# EAGLE design Arduino-lilypad-USB (EAGLE 6.3)
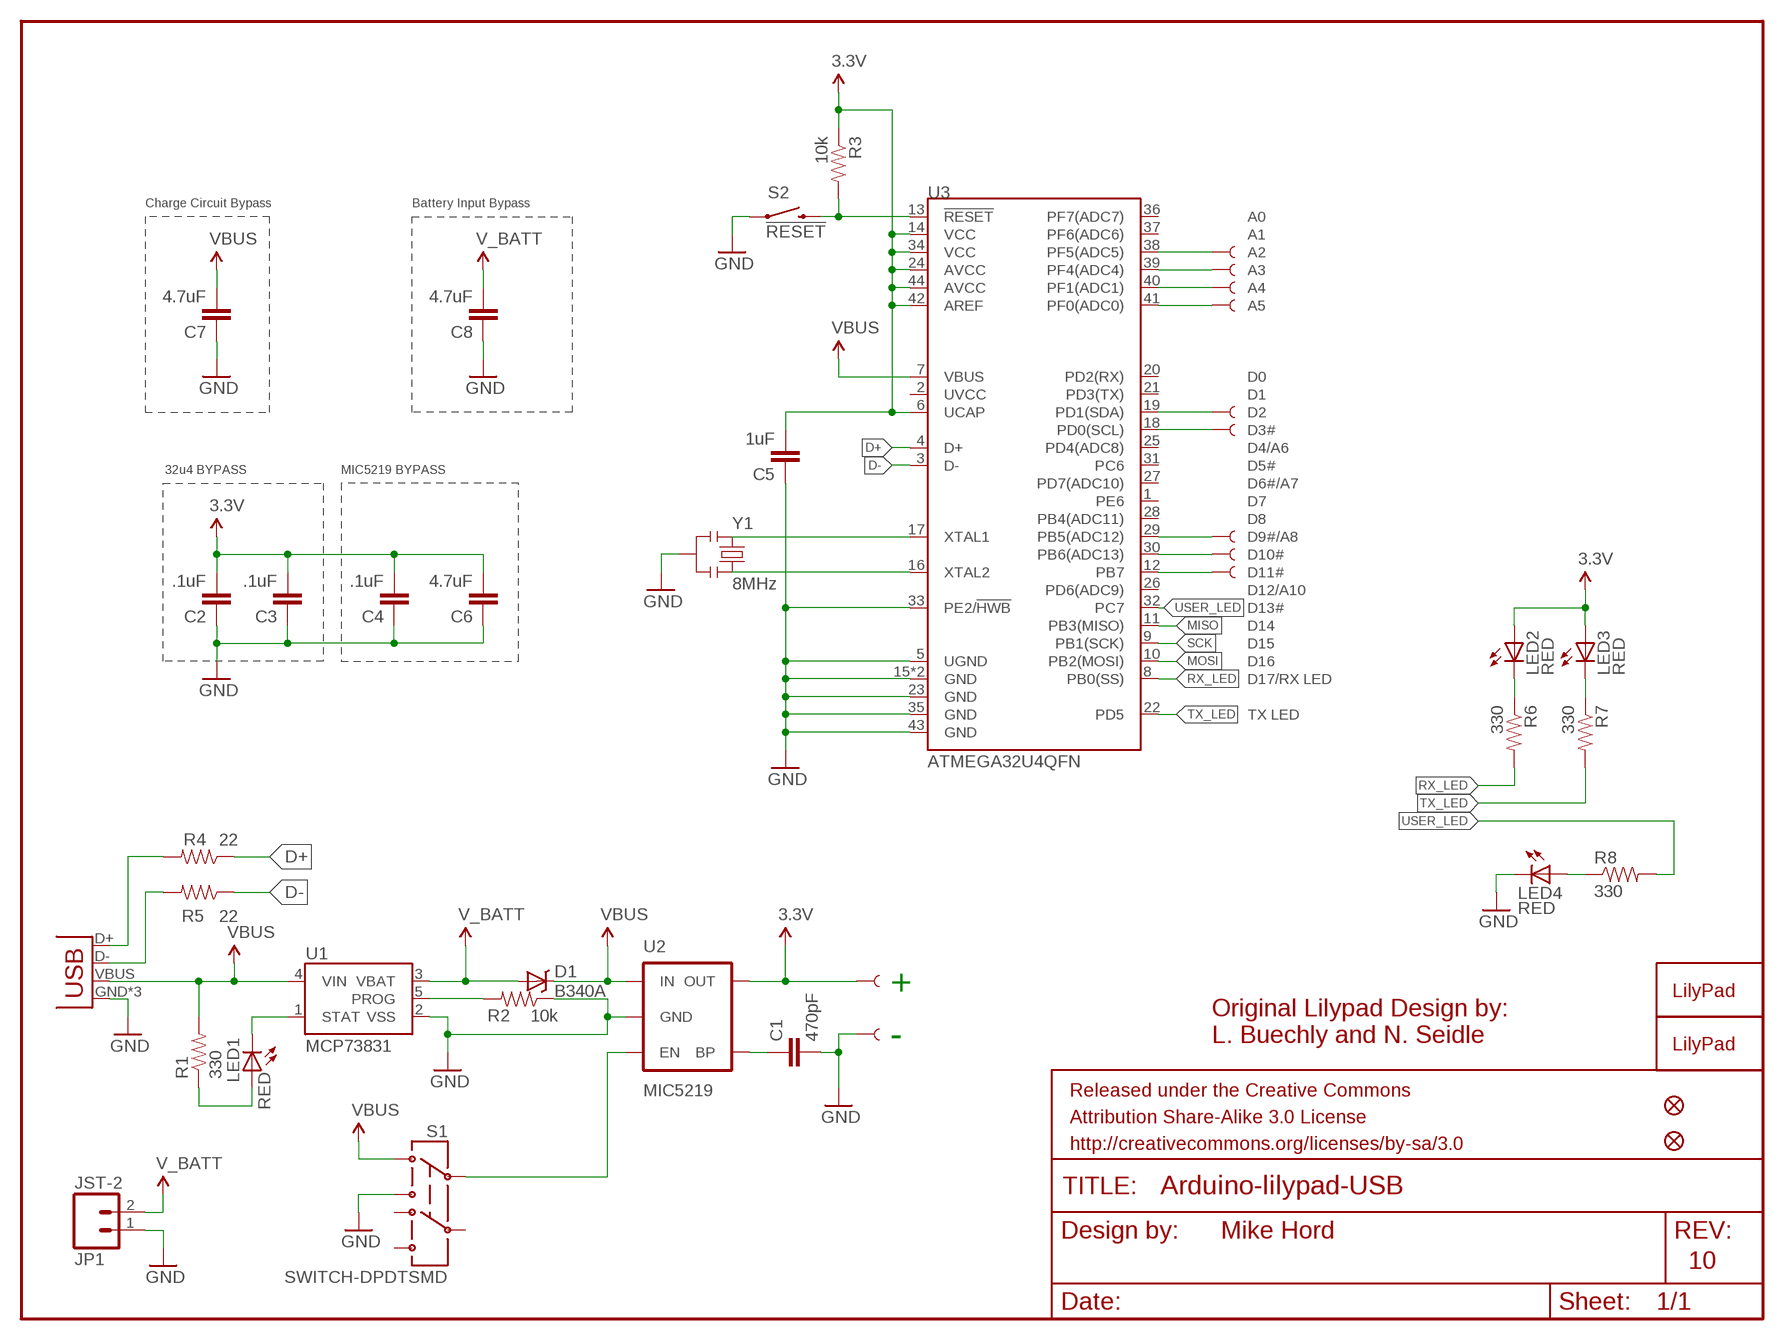
[diagram p0: schematic, sheet 1]

## Parts
+  SEWTAP9  [PETAL-LONG-1-2SIDE]
-  SEWTAP9  [PETAL-LONG-1-2SIDE]
A2  SEWTAP9  [PETAL-LONG-1-2SIDE]
A3  SEWTAP9  [PETAL-LONG-1-2SIDE]
A4  SEWTAP9  [PETAL-LONG-1-2SIDE]
A5  SEWTAP9  [PETAL-LONG-1-2SIDE]
C1  470pF  CAP0603-CAP  [0603-CAP]
C2  .1uF  CAP0603-CAP  [0603-CAP]
C3  .1uF  CAP0603-CAP  [0603-CAP]
C4  .1uF  CAP0603-CAP  [0603-CAP]
C5  1uF  CAP0603-CAP  [0603-CAP]
C6  4.7uF  CAP0603-CAP  [0603-CAP]
C7  4.7uF  CAP1206  [1206]
C8  4.7uF  CAP1206  [1206]
D1  B340A  DIODE-SCHOTTKY_  [SMA-DIODE]
D5  SEWTAP9  [PETAL-LONG-1-2SIDE]
D6  SEWTAP9  [PETAL-LONG-1-2SIDE]
D9  SEWTAP9  [PETAL-LONG-1-2SIDE]
D10  SEWTAP9  [PETAL-LONG-1-2SIDE]
D11  SEWTAP9  [PETAL-LONG-1-2SIDE]
JP1  JST-2  M02-JST-2MM-SMT  [JST-2-SMD]
JP2  FIDUCIALUFIDUCIAL  [MICRO-FIDUCIAL]
JP3  FIDUCIALUFIDUCIAL  [MICRO-FIDUCIAL]
LED1  RED  LED0603  [LED-0603]
LED2  RED  LED0603  [LED-0603]
LED3  RED  LED0603  [LED-0603]
LED4  RED  LED0603  [LED-0603]
R1  330  RESISTOR0603-RES  [0603-RES]
R2  10k  RESISTOR0603-RES  [0603-RES]
R3  10k  RESISTOR0603-RES  [0603-RES]
R4  22  RESISTOR0603-RES  [0603-RES]
R5  22  RESISTOR0603-RES  [0603-RES]
R6  330  RESISTOR0603-RES  [0603-RES]
R7  330  RESISTOR0603-RES  [0603-RES]
R8  330  RESISTOR0603-RES  [0603-RES]
S1  SWITCH-DPDTSMD  [AYZ0202]
S2  !RESET  SWITCH-MOMENTARY-2SMD  [TACTILE_SWITCH_SMD]
U1  MCP73831  [SOT23-5]
U2  MIC5219  V_REG_MIC5219SMD  [SOT23-5]
U3  ATMEGA32U4QFN  [QFN-44]
U$1  LOGO-LPLPA  [LOGO-LPA]
U$13  LOGO-LPLP  [LOGO-LILYPAD]
X1  USB-MICROB  [USB-MICROB]
Y1  8MHz  RESONATORSMD  [RESONATOR-SMD]

## Nets
3.3V: +.1 C2.2 C3.2 C4.2 C5.2 C6.2 LED2.A LED3.A R3.1 U2.5(OUT) U3.6(UCAP) U3.14(VCC) U3.24(AVCC) U3.34(VCC) U3.42(AREF) U3.44(AVCC)
5V: C7.2 D1.C R1.2 S1.1 U1.4(VIN) U2.1(IN) U3.7(VBUS) X1.VBUS ; supply symbol labelled VBUS
D+: R4.1 U3.4(D+)
D-: R5.1 U3.3(D-)
GND: -.1 C1.2 C2.1 C3.1 C4.1 C5.1 C6.1 C7.1 C8.1 JP1.1 LED4.C R2.1 S1.3 S2.1 U1.2(VSS) U2.2(GND) U3.5(UGND) U3.15(GND) U3.23(GND) U3.33(PE2/!HWB) U3.35(GND) U3.43(GND) U3.EPAD(GND) X1.GND X1.MT1(GND) X1.MT2(GND) Y1.2
MISO: U3.11(PB3(MISO))
MOSI: U3.10(PB2(MOSI))
N$1: LED2.C R6.1
N$2: S1.2 U2.3(EN)
N$3: LED1.A R1.1
N$4: LED1.C U1.1(STAT)
N$5: U3.17(XTAL1) Y1.1
N$6: R2.2 U1.5(PROG)
N$7: U3.16(XTAL2) Y1.3
N$8: C1.1 U2.4(BP)
N$9: D11.1 U3.12(PB7)
N$10: D10.1 U3.30(PB6(ADC13))
N$11: D9.1 U3.29(PB5(ADC12))
N$12: D5.1 U3.19(PD1(SDA))
N$13: D6.1 U3.18(PD0(SCL))
N$14: A5.1 U3.41(PF0(ADC0))
N$15: A4.1 U3.40(PF1(ADC1))
N$16: A3.1 U3.39(PF4(ADC4))
N$17: A2.1 U3.38(PF5(ADC5))
N$18: LED4.A R8.1
N$19: R5.2 X1.D-
N$20: R4.2 X1.D+
N$21: LED3.C R7.1
RESET: R3.2 S2.3 U3.13(!RESET)
RX_LED: R6.2 U3.8(PB0(SS))
SCK: U3.9(PB1(SCK))
TX_LED: R7.2 U3.22(PD5)
USER_LED: R8.2 U3.32(PC7)
V_BATT: C8.2 D1.A JP1.2 U1.3(VBAT)
Unconnected: S1.4 S1.5 S1.6 U3.1(PE6) U3.2(UVCC) U3.20(PD2(RX)) U3.21(PD3(TX)) U3.25(PD4(ADC8)) U3.26(PD6(ADC9)) U3.27(PD7(ADC10)) U3.28(PB4(ADC11)) U3.31(PC6) U3.36(PF7(ADC7)) U3.37(PF6(ADC6))

## Notes on the sheet
- Charge Circuit Bypass | Battery Input Bypass
- 32u4 BYPASS | MIC5219 BYPASS
- +
- Original Lilypad Design by:
- - | L. Buechly and N. Seidle
- Mike Hord
- 10

## Library data of the parts
+ - A2-A5 D5 D6 D9-D11 = LilyPad-Wearables:SEWTAP; NO_PART: 1
C1 = SparkFun-Passives:CAP: Capacitor Standard 0603 ceramic capacitor, and 0.1" leaded capacitor.; PROD_ID: CAP-07884
C2-C4 = SparkFun-Passives:CAP: Capacitor Standard 0603 ceramic capacitor, and 0.1" leaded capacitor.; PROD_ID: CAP-00810
C5 = SparkFun-Passives:CAP: Capacitor Standard 0603 ceramic capacitor, and 0.1" leaded capacitor.; PROD_ID: CAP-00868
C6 = SparkFun-Passives:CAP: Capacitor Standard 0603 ceramic capacitor, and 0.1" leaded capacitor.; PROD_ID: CAP-08280
C7 C8 = SparkFun-Passives:CAP: Capacitor Standard 0603 ceramic capacitor, and 0.1" leaded capacitor.; PROD_ID: CAP-10300
D1 = SparkFun-DiscreteSemi:DIODE-SCHOTTKY: Commonly MBRA140.; PROD_ID: DIO-09886
JP1 = SparkFun-Connectors:M02: Header 2 Standard 2-pin 0.1" header. Use with straight break away headers (SKU : PRT-00116), right angle break away headers (PRT-00553), swiss pins (PRT-00743), machine pins (PRT-00117), and female headers (PRT-00115). Molex polarized connector foot print use with SKU : PRT-08233 with associated crimp pins and housings.; PROD_ID: CONN-08352
JP2 JP3 = SparkFun:FIDUCIAL: Fiducial Alignment Points Various fiducial points for machine vision alignment.
LED1-LED4 = SparkFun-LED:LED: LEDs Standard schematic elements and footprints for 5mm, 3mm, 1206, and 0603 sized LEDs. 5mm - Spark Fun Electronics SKU : COM-00529 (and others); PROD_ID: DIO-00819
R1 R6-R8 = SparkFun-Passives:RESISTOR: Resistor Basic schematic elements and footprints for 0603, 1206, and PTH resistors.; PROD_ID: RES-00818
R2 R3 = SparkFun-Passives:RESISTOR: Resistor Basic schematic elements and footprints for 0603, 1206, and PTH resistors.; PROD_ID: RES-00824
R4 R5 = SparkFun-Passives:RESISTOR: Resistor Basic schematic elements and footprints for 0603, 1206, and PTH resistors.; PROD_ID: RES-08698
S1 = SparkFun-Electromechanical:SWITCH-DPDT: DPDT Version of the COM-00597; PROD_ID: SWCH-08179
S2 = SparkFun-Electromechanical:SWITCH-MOMENTARY-2: Various NO switches- pushbuttons, reed, etc; PROD_ID: SWCH-08247
U1 = SparkFun-PowerIC:MCP73831: Miniature single cell, fully integrated Li-Ion, Li-polymer charge management controller http://ww1.microchip.com/downloads/en/DeviceDoc/21984a.pdf; PROD_ID: IC-09995
U2 = SparkFun-PowerIC:V_REG_MIC5219: V_REG MIC5219 Standard 500mA LDO voltage regulator in SOT-23 layout. Micrel part MIC5219. BP (by-pass) pin is used to lower output noise with 470pF cap, may be left open.; PROD_ID: VREG-09872
U3 = SparkFun-DigitalIC:ATMEGA32U4: Atmel 44-pin 8-bit Microcontroller with 32KBytes of ISP Flash and USB Controller; PROD_ID: IC-10828
U$1 = LilyPad-Wearables:LOGO-LP
U$13 = LilyPad-Wearables:LOGO-LP; NO_PART: 1
X1 = SparkFun-Connectors:USB: USB Connectors USB-B-PTH is fully proven SKU : PRT-00139 USB-miniB is fully proven SKU : PRT-00587 USB-A-PCB is untested. USB-A-H is throughly reviewed, but untested. Spark Fun Electronics SKU : PRT-00437 USB-B-SMT is throughly reviewed, but untested. Needs silkscreen touching up. USB-A-S has not been used/tested USB-MB-H has not been used/tested; PROD_ID: CONN-09505
Y1 = SparkFun-FreqCtrl:RESONATOR: Resonator Small SMD resonator. This is the itty bitty 10/20MHz resonators with built in caps. CSTCE10M0G55 and CSTCE20M0V53. Footprint has been reviewed closely but hasn't been tested yet.; PROD_ID: XTAL-08895

## Board
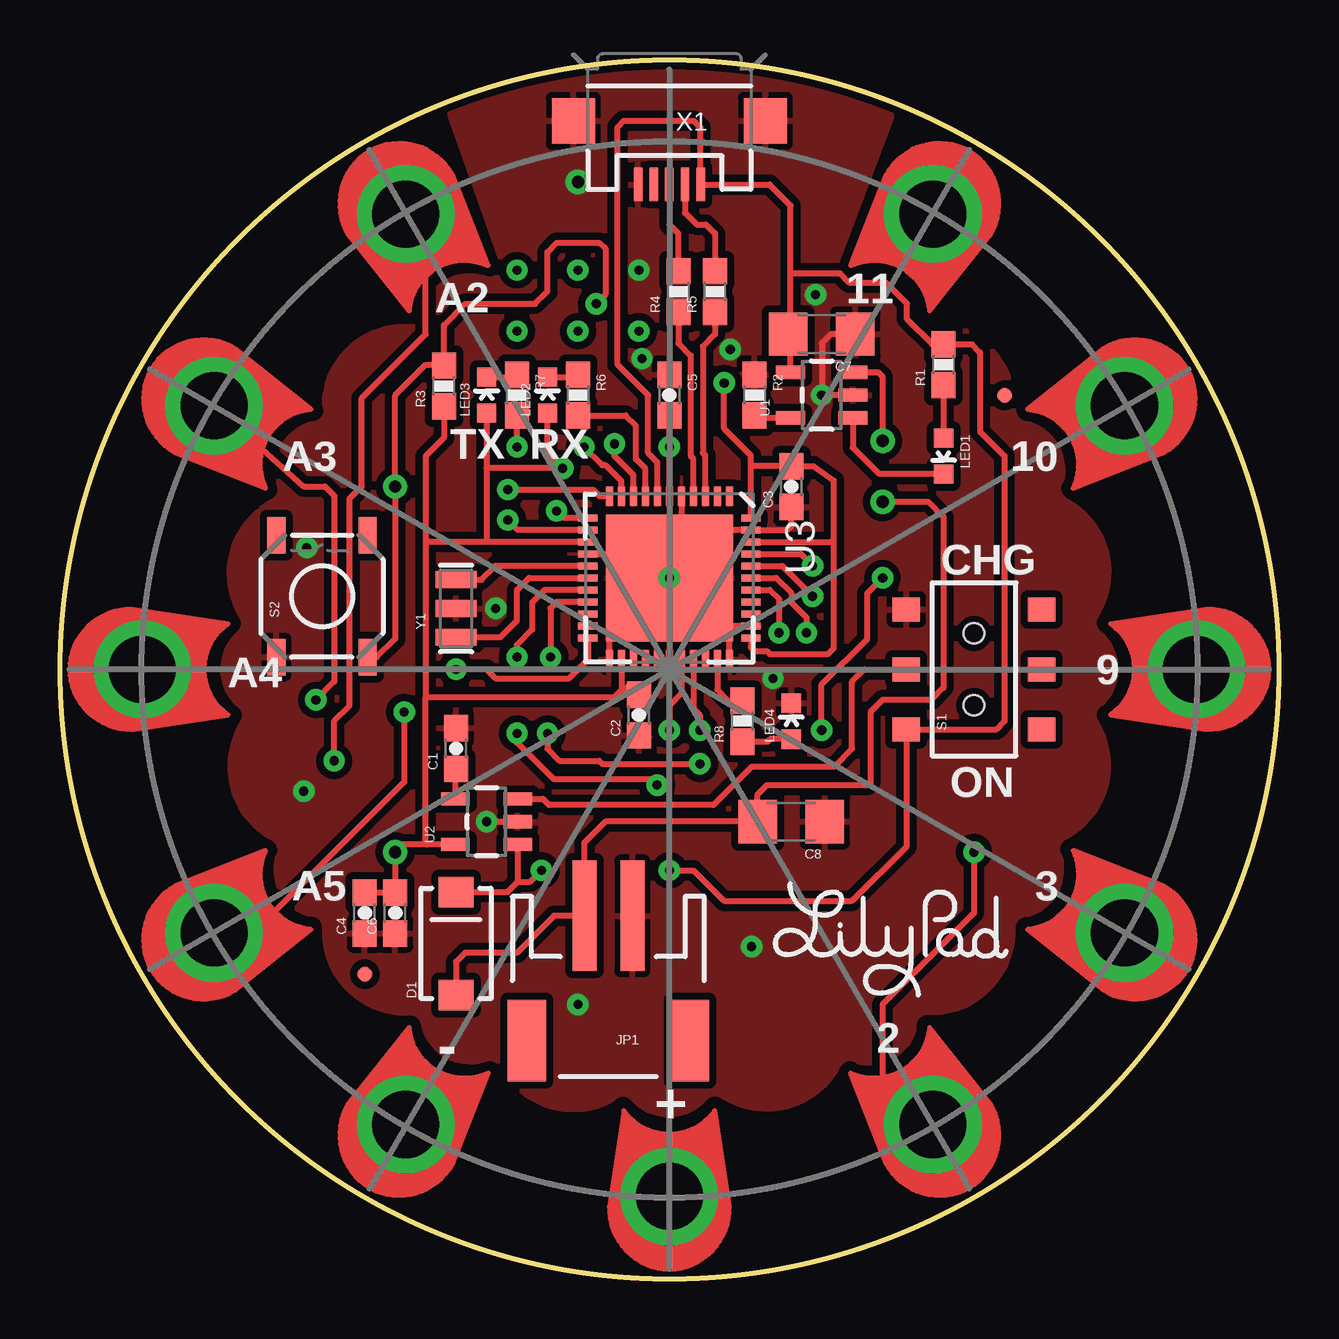
[diagram p1: board, top side]
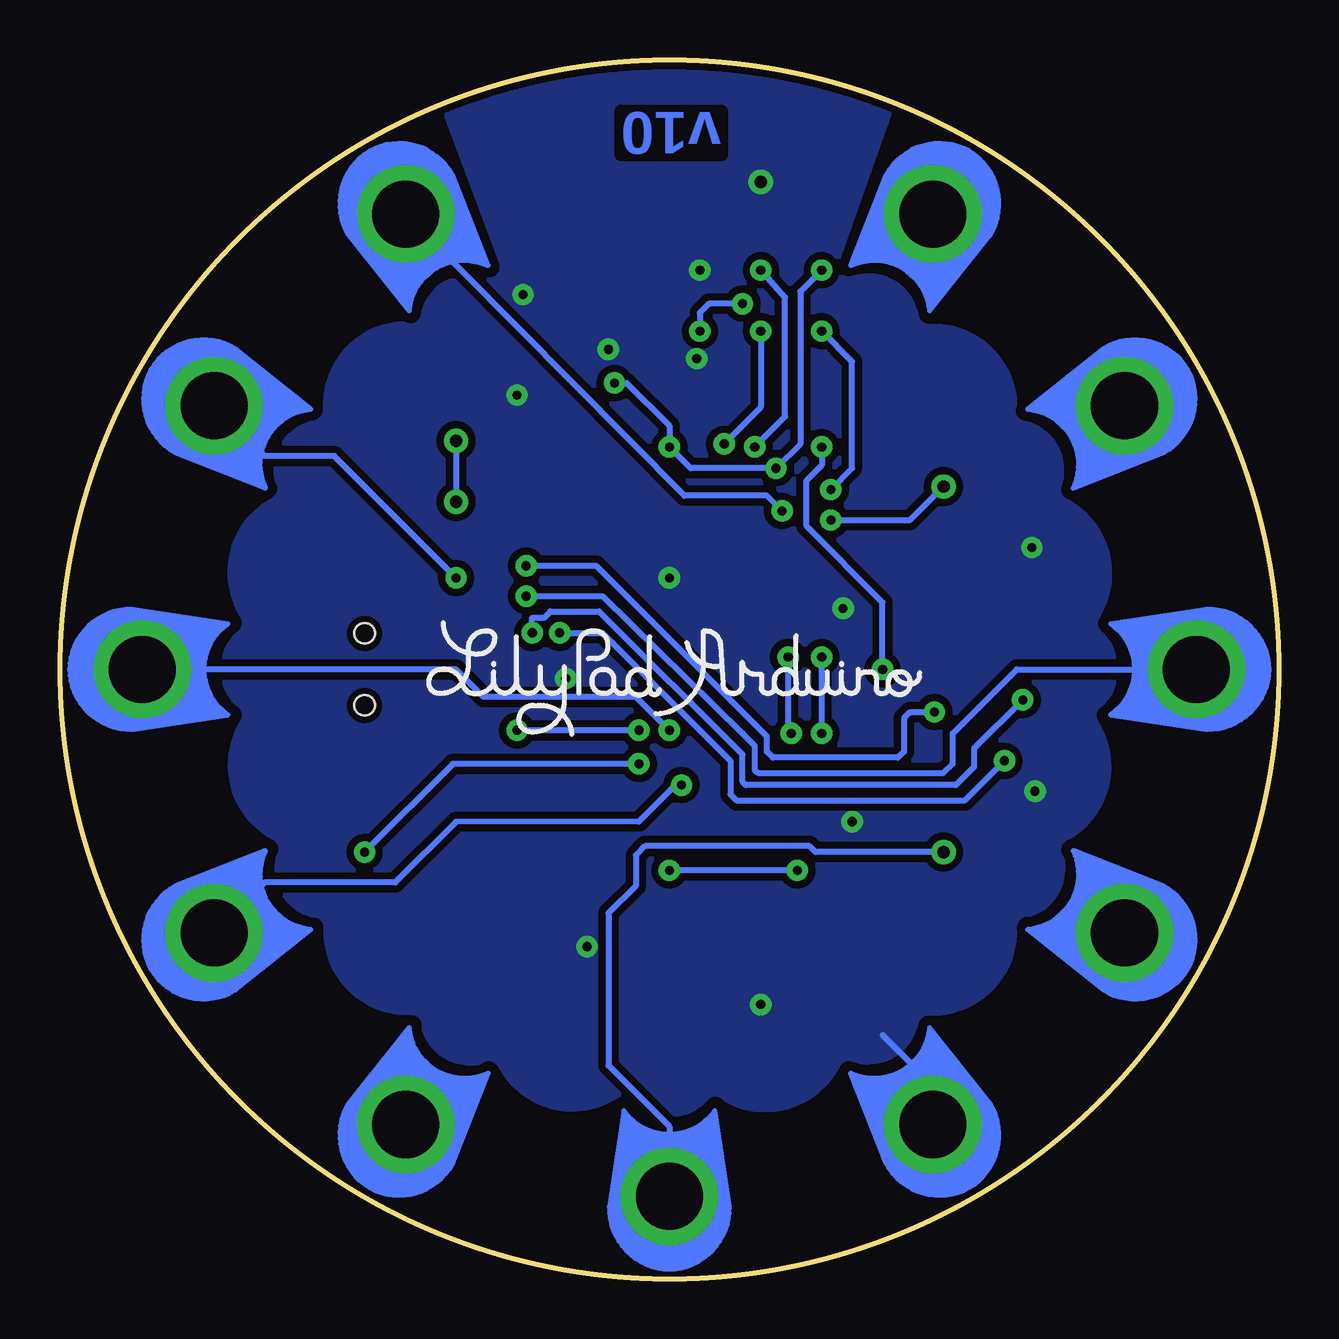
[diagram p2: board, bottom side, seen from below]

Size 50.8 x 50.8 mm. Coordinates in mm from the lower left corner, seen from the top.
Outline: circle at 25.4,25.4 radius 25.4
Copper layers (1*16): Top 0.035mm / dielectric 1.5mm / Bottom 0.035mm
Design rules "default": minimum track width 8mil, minimum drill 20mil, track to track 8mil, track to pad 8mil, pad to pad 8mil, via to via 8mil, smd to smd 8mil, copper to edge 8mil, drill to drill 8mil, minimum pad ring 12mil, minimum via ring 10mil, stop-mask expansion 4mil, vias tented up to drill 20mil, thermal gap 10mil
tRestrict: area 2.1,32.9 to 10.5,40.7; area 40.3,10.1 to 48.7,17.9; area 0.3,22.4 to 7.1,28.6; area 43.7,22.2 to 50.5,28.4; area 32.9,2 to 40.6,10.5; area 40.3,32.9 to 48.8,40.6; area 2,10.2 to 10.5,17.9; area 10.2,40.3 to 17.9,48.8; area 32.9,40.3 to 40.7,48.7; area 10.1,2.1 to 17.9,10.5; area 0.3,27.3 to 8.6,35.3; area 5.2,36.2 to 14.6,45.6; area 42.2,27.3 to 50.5,35.3; area 36.2,36.2 to 45.6,45.6; area 5.2,5.2 to 14.6,14.7; area 0.3,15.5 to 8.6,23.5; area 27.3,0.3 to 35.3,8.6; area 15.5,0.3 to 23.5,8.6; area 36.1,5.2 to 45.6,14.6; area 42.1,15.5 to 50.5,23.5; area 22.2,0.3 to 28.4,7.2
bRestrict: area 0.3,22.4 to 7.1,28.6; area 43.7,22.2 to 50.5,28.4; area 32.9,2 to 40.6,10.5; area 40.3,32.9 to 48.8,40.6; area 2,10.2 to 10.5,17.9; area 10.2,40.3 to 17.9,48.8; area 32.9,40.3 to 40.7,48.7; area 10.1,2.1 to 17.9,10.5; area 0.3,27.3 to 8.6,35.3; area 5.2,36.2 to 14.6,45.6; area 42.2,27.3 to 50.5,35.3; area 36.2,36.2 to 45.6,45.6; area 5.2,5.2 to 14.6,14.7; area 0.3,15.5 to 8.6,23.5; area 27.3,0.3 to 35.3,8.6; area 15.5,0.3 to 23.5,8.6; area 36.1,5.2 to 45.6,14.6; area 42.1,15.5 to 50.5,23.5; area 22.2,0.3 to 28.4,7.2; area 2.1,32.9 to 10.5,40.7; area 40.3,10.1 to 48.7,17.9

### Footprints (pad centres in the part's own frame; a part is rotated, then mirrored left to right if it is on the bottom)
PETAL-LONG-1-2SIDE = drill 2.794 pad 4.064: 1 0.03,0
0603-CAP = smd 1.1 x 1: 1 -0.85,0; 2 0.85,0
1206 = smd 1.6 x 1.8: 1 -1.4,0; 2 1.4,0
SMA-DIODE = smd 1.27 x 1.47: A -2.15,0; C 2.15,0
JST-2-SMD = smd 1 x 4.6: 1 -1,-3.7; 2 1,-3.7 | smd 1.6 x 3.4: NC1 -3.4,1.5; NC2 3.4,1.5
MICRO-FIDUCIAL = smd 0.635 x 0.635: 1 0,0
LED-0603 = smd 0.8 x 0.8: A 0,-0.75; C 0,0.75
0603-RES = smd 1.1 x 1: 1 -0.85,0; 2 0.85,0
AYZ0202 = smd 1 x 1.15: 1 -2.5,2.825; 2 0,2.825; 3 2.5,2.825; 4 -2.5,-2.825; 5 0,-2.825; 6 2.5,-2.825 | hole 0.85: 1.5,0; -1.5,0
TACTILE_SWITCH_SMD = smd 1.524 x 0.762: 1 -2.54,1.905; 2 2.54,1.905; 3 -2.54,-1.905; 4 2.54,-1.905
SOT23-5 = smd 0.55 x 1.2: 1 -0.95,-1.3; 2 0,-1.3; 3 0.95,-1.3; 4 0.95,1.3; 5 -0.95,1.3
QFN-44 = smd 0.8 x 0.3: 1 -3.4,2.5; 2 -3.4,2; 3 -3.4,1.5; 4 -3.4,1; 5 -3.4,0.5; 6 -3.4,0; 7 -3.4,-0.5; 8 -3.4,-1; 9 -3.4,-1.5; 10 -3.4,-2; 11 -3.4,-2.5; 23 3.4,-2.5; 24 3.4,-2; 25 3.4,-1.5; 26 3.4,-1; 27 3.4,-0.5; 28 3.4,0; 29 3.4,0.5; 30 3.4,1; 31 3.4,1.5; 32 3.4,2; 33 3.4,2.5 | smd 0.3 x 0.8: 12 -2.5,-3.4; 13 -2,-3.4; 14 -1.5,-3.4; 15 -1,-3.4; 16 -0.5,-3.4; 17 0,-3.4; 18 0.5,-3.4; 19 1,-3.4; 20 1.5,-3.4; 21 2,-3.4; 22 2.5,-3.4; 34 2.5,3.4; 35 2,3.4; 36 1.5,3.4; 37 1,3.4; 38 0.5,3.4; 39 0,3.4; 40 -0.5,3.4; 41 -1,3.4; 42 -1.5,3.4; 43 -2,3.4; 44 -2.5,3.4 | smd 5.3 x 5.3: EPAD 0,0
USB-MICROB = smd 0.35 x 1.4: D+ 0,2.65; D- -0.65,2.65; GND 1.3,2.65; ID 0.65,2.65; VBUS -1.3,2.65 | smd 1.8 x 1.9: MT1 -4,0; MT2 4,0
RESONATOR-SMD = smd 0.7 x 1.7: 1 -1.2,0; 2 0,0; 3 1.2,0

### Placement (x,y rotation side)
+  25.4,3.4 90 top
-  14.4,6.4 60 top
A2  14.4,44.4 300 top
A3  6.4,36.4 330 top
A4  3.4,25.4 0 top
A5  6.4,14.4 30 top
C1  16.51,22.1 90 top
C2  24.13,23.5 90 top
C3  30.48,33.02 90 top
C4  12.7,15.24 90 top
C5  25.4,36.83 270 top
C6  13.97,15.24 90 top
C7  31.75,39.37 180 top
C8  30.48,19.05 180 top
D1  16.51,13.97 90 top
D5  36.4,6.4 120 top
D6  44.4,14.4 150 top
D9  47.4,25.4 180 top
D10  44.4,36.4 210 top
D11  36.4,44.4 240 top
JP1  22.86,11.43 180 top
JP2  12.7,12.7 0 top
JP3  39.37,36.83 0 top
LED1  36.83,34.29 180 top
LED2  20.32,36.83 0 top
LED3  17.78,36.83 0 top
LED4  30.48,23.24 0 top
R1  36.83,38.1 90 top
R2  28.96,36.83 270 top
R3  16,37.21 90 top
R4  25.78,41.15 90 top
R5  27.3,41.15 90 top
R6  21.59,36.83 270 top
R7  19.05,36.83 270 top
R8  28.45,23.24 90 top
S1  38.1,25.4 90 top
S2  10.92,28.45 90 top
U1  31.75,36.83 90 top
U2  17.78,19.05 90 top
U3  25.4,29.21 270 top
U$1  25.4,25.4 0 bottom
U$13  34.67,14.48 0 top
X1  25.4,48.26 180 top
Y1  16.51,27.94 90 top

### Tracks (layer width: path | path; a pad name or v marks a point on that pad's centre or on a via)
3.3V  (via drill 0.38, 0.51)
  Top 0.254: 16.19,18.1 U2.5 15.3,18.1 | 15.24,24.26 15.24,18.16 15.3,18.1 | U3.44 28.8,33.91 | 28.8,33.91 28.8,34.32 27.69,35.43 v27.69,37.34 | 32.26,30.73 32.26,26.29 32,26.04 29.59,26.04 29.46,26.16 28.96,26.16 28.8,26.32 U3.34 | 32.26,30.73 32.26,33.27 31.41,33.87 C3.2 28.87,33.87 28.83,33.91 28.8,33.91 | U3.42 32.11,30.71 32.26,30.73 | U3.6 v25.4,34.67 C5.2 | LED3.A 17.78,33.78 | 17.78,33.78 17.78,30.73 17.8,30.71 | U3.14 17.8,30.71 | LED2.A 20.32,34.42 v20.95,33.78 17.78,33.78 | 15.3,18.1 14.29,18.1 v13.97,17.78 C6.2 C4.2 | R3.1 16,35.05 15.24,34.29 15.24,30.86 | 15.24,30.86 15.24,24.26 | 17.8,30.71 15.39,30.71 15.24,30.86 | C2.2 24.13,24.51 23.88,24.76 23.75,24.76 23.53,24.54 23.4,24.54 | 15.24,24.26 23.11,24.26 23.4,24.54 | U3.24 23.4,24.54
  Bottom 0.254: v27.69,37.34 27.18,37.34 25.4,35.56 v25.4,34.67 24.51,33.78 v20.95,33.78 19.94,34.8 19.94,41.15 v19.05,42.04 | v13.97,17.78 19.3,17.78 19.56,18.03 26.42,18.03 26.8,17.65 26.8,16.38 27.94,15.24 27.94,8.89 25.4,6.35 +.1
5V  (via drill 0.38)
  Top 0.254: U1.4 30.45,39.27 | 30.45,39.27 C7.2 | U3.7 24.9,34.03 24.51,34.42 24.51,36.83 23.24,38.1 23.24,48.01 23.49,48.26 26.42,48.26 26.7,47.98 X1.VBUS 29.57,45.61 30.45,44.73 30.45,41.91 | 30.45,41.91 32.51,41.91 32.89,41.53 34.42,41.53 35.31,40.64 35.31,40 36.36,38.95 R1.2 38.01,38.95 38.35,38.61 38.35,35.31 39.37,34.29 39.37,23.24 39.03,22.9 S1.1 35.27,18 33.02,15.75 27.69,15.75 26.42,17.02 v25.4,17.02 | D1.C 18.66,16.12 19.08,16.54 | U2.1 19.08,16.54 | 19.08,16.54 19.59,16.54 v20.07,17.02 | 30.45,39.27 30.45,41.91
  Bottom 0.254: v20.07,17.02 v25.4,17.02
D+
  Top 0.254: U3.4 26.4,34.18 26.29,34.29 26.29,38.48 25.78,38.99 R4.1
D-
  Top 0.254: U3.3 26.9,34.31 26.8,34.42 26.8,38.86 27.3,39.37 R5.1
GND  (via drill 0.38, 0.51)
  Top 0.254: U1.2 v31.75,36.83 31.75,38.99 32.13,39.37 C7.1 | U2.2 v17.78,19.05 | U3.23 22.9,26.71 U3.EPAD | U3.5 25.9,29.71 U3.EPAD | U3.EPAD 27.4,31.21 U3.43 30.32,31.21 30.48,31.37 C3.1 | U3.35 27.4,27.21 U3.EPAD | U3.33 27.9,26.71 U3.EPAD | U3.15 24.4,30.21 U3.EPAD
  Bottom 0.254: -.1 14.41,8.06 16.51,10.16
  other vias: 25.4,29.21 24.13,42.04 21.59,11.43 28.83,13.84 10.16,20.32 27.94,38.73 10.29,30.48 24.26,38.35 31.5,41.02 21.59,45.72 18.16,27.94 29.72,25.02
  pour Top (isolate 0.305): 50.8,25.4 arc90 25.4,50.8 arc90 0,25.4 arc90 25.4,0 arc90
  pour Bottom (isolate 0.305): 50.8,25.4 arc90 25.4,50.8 arc90 0,25.4 arc90 25.4,0 arc90
MISO  (via drill 0.38)
  Top 0.254: v18.67,32.89 22.22,32.89 22.51,32.61 U3.11
  Bottom 0.254: v18.67,32.89 17.78,33.78 17.78,38.23 v19.05,39.5
MOSI  (via drill 0.38)
  Top 0.254: U3.10 23.4,33.24 22.73,33.91 22.61,33.91 v21.84,34.67
  Bottom 0.254: v21.84,34.67 20.57,35.94 20.57,40.89 v21.59,42.04
N$1
  Top 0.254: LED2.C 21.49,37.58 R6.1
N$2
  Top 0.254: S1.2 33.53,25.4 33.02,24.89 33.02,22.1 32.26,21.34 28.83,21.34 27.24,19.75 20.39,19.75 20.13,20 U2.3
N$3
  Top 0.254: R1.1 LED1.A
N$4
  Top 0.254: U1.1 33.05,34.64 34.15,33.54 LED1.C
N$5
  Top 0.254: Y1.1 18.36,26.74 19.05,27.43 19.05,28.7 19.56,29.21 U3.17
N$6
  Top 0.254: U1.5 29.31,35.88 R2.2
N$7
  Top 0.254: Y1.3 17.58,29.14 18.15,29.71 U3.16
N$8
  Top 0.254: U2.4 16.48,21.98 C1.1
N$9  (via drill 0.38)
  Top 0.254: U3.12 20.99,31.71 v20.7,32
  Bottom 0.254: D11.1 24.78,32.64 21.34,32.64 v20.7,32
N$10  (via drill 0.38)
  Top 0.254: U3.30 26.4,23.76 26.67,23.49 v26.67,22.86 | v31.75,22.86 31.75,24.76 33.66,26.67 33.66,28.57 v34.29,29.21
  Bottom 0.254: v26.67,22.86 v31.75,22.86 | v34.29,29.21 39.37,34.29 42.28,34.29 D10.1
N$11  (via drill 0.38)
  Top 0.254: U3.29 25.9,24.39 25.4,23.88 v25.4,22.86
  Bottom 0.254: v25.4,22.86 26.8,24.26 33.15,24.26 34.29,25.4 D9.1
N$12  (via drill 0.38)
  Top 0.254: U3.19 20.72,28.21 20.45,27.94 v20.45,25.91 | v20.32,22.73 20.32,22.1 20.83,21.59 22.48,21.59 22.61,21.46 v26.67,21.46 | v38.1,17.78 38.1,15.24 34.29,11.43 34.29,8.52 D5.1
  Bottom 0.254: v20.45,25.91 20.45,22.86 v20.32,22.73 | v26.67,21.46 34.42,21.46 v38.1,17.78
N$13  (via drill 0.38)
  Top 0.254: U3.18 20.2,28.71 19.68,28.19 19.68,27.05 19.05,26.42 v19.05,25.91 | v19.05,22.73 19.05,22.35 20.57,20.83 24.64,20.83 v24.89,20.57
  Bottom 0.254: v19.05,25.91 v19.05,22.73 | v24.89,20.57 25.15,20.57 26.67,19.05 34.29,19.05 36.83,16.51 42.28,16.51 D6.1
N$14  (via drill 0.38)
  Top 0.254: U3.41 30.88,30.21 v31.37,29.72 | v14.35,23.62 14.35,20.7 7.62,13.97 6.87,13.97 A5.1
  Bottom 0.254: v31.37,29.72 28.45,29.72 21.34,22.61 21.34,21.97 21.08,21.72 15.87,21.72 15.62,21.97 15.62,23.37 15.37,23.62 v14.35,23.62
N$15  (via drill 0.38)
  Top 0.254: U3.40 30.11,29.71 v31.37,28.45
  Bottom 0.254: v31.37,28.45 28.19,28.45 22.35,22.73 21.84,22.22 21.84,21.21 21.72,21.08 13.97,21.08 13.59,21.46 13.59,22.73 10.92,25.4 A4.1
N$16  (via drill 0.38)
  Top 0.254: U3.39 29.84,29.21 30.48,28.57 30.48,28.19 31.11,27.56 v31.11,26.92 | A3.1 10.16,33.02 11.05,33.02 11.43,32.64 11.43,24.89 v10.67,24.13
  Bottom 0.254: v31.11,26.92 31.11,27.56 30.61,27.56 30.35,27.81 28.32,27.81 22.35,21.84 22.35,20.7 22.22,20.57 13.46,20.57 12.7,21.34 12.7,22.1 v10.67,24.13
N$17  (via drill 0.38)
  Top 0.254: U3.38 29.58,28.71 29.97,28.32 v29.97,26.92 | v11.43,21.59 11.43,23.24 12.06,23.88 12.06,32.51 12.57,33.02 12.57,36.7 15.24,39.37 15.24,43.55 A2.1 14.35,44.31
  Bottom 0.254: v29.97,26.92 28.19,26.92 22.86,21.59 22.86,20.19 22.61,19.94 13.08,19.94 v11.43,21.59
N$18
  Top 0.254: R8.1 29.5,22.39 29.6,22.49 LED4.A
N$19
  Top 0.254: X1.D- 26.05,44.44 26.54,43.94 26.92,43.94 27.3,43.56 R5.2
N$20
  Top 0.254: X1.D+ 25.4,43.94 25.78,43.56 R4.2
N$21
  Top 0.254: LED3.C 18.95,37.58 R7.1
RESET  (via drill 0.38, 0.51)
  Top 0.254: U3.13 19.08,31.21 v18.67,31.62 | v22.35,40.64 22.73,41.02 22.73,42.93 22.48,43.18 20.7,43.18 20.32,42.8 20.32,41.15 19.81,40.64 16.89,40.64 16,39.75 R3.2 15.96,38.1 15.24,38.1 13.97,36.83 v13.97,33.02 13.97,26.67 13.21,25.91 S2.3
  Bottom 0.254: v22.35,40.64 23.75,40.64 24.13,40.26 v24.13,39.5 | v18.67,31.62 15.37,31.62 v13.97,33.02
RX_LED
  Top 0.254: U3.8 24.4,33.77 24,34.16 24,35.56 23.58,35.98 R6.2
SCK  (via drill 0.38)
  Top 0.254: U3.9 23.9,33.5 23.11,34.29 v23.11,34.8
  Bottom 0.254: v21.59,39.5 21.59,36.32 v23.11,34.8
TX_LED  (via drill 0.38)
  Top 0.254: v19.05,34.67 R7.2 | v16.51,25.4 17.78,25.4 18.16,25.02 21.21,25.02 22,25.81 U3.22
  Bottom 0.254: v19.05,34.67 19.05,33.91 19.68,33.27 19.68,31.37 16.51,28.19 v16.51,25.4
USER_LED
  Top 0.254: R8.2 27.85,24.09 27.4,24.54 U3.32
V_BATT  (via drill 0.51)
  Top 0.254: U1.3 34.1,37.78 34.29,37.59 v34.29,34.92 | D1.A 16.51,13.21 16.89,13.59 19.05,13.59 20.59,15.13 JP1.2 21.86,18.18 22.73,19.05 C8.2 29.08,20.19 29.46,20.57 33.66,20.57 33.78,20.7 33.78,23.62 34.29,24.13 36.32,24.13 36.83,24.64 36.83,31.75 36.2,32.38 v34.29,32.38
  Bottom 0.254: v34.29,34.92 v34.29,32.38

### Text on the board
Bottom: v10
tPlace: A2 | 11 | TX | RX | A3 | 10 | CHG | A4 | 9 | ON | A5 | 3 | 2 | - | +